# EAGLE design LT3465Breakout (EAGLE 6.1)
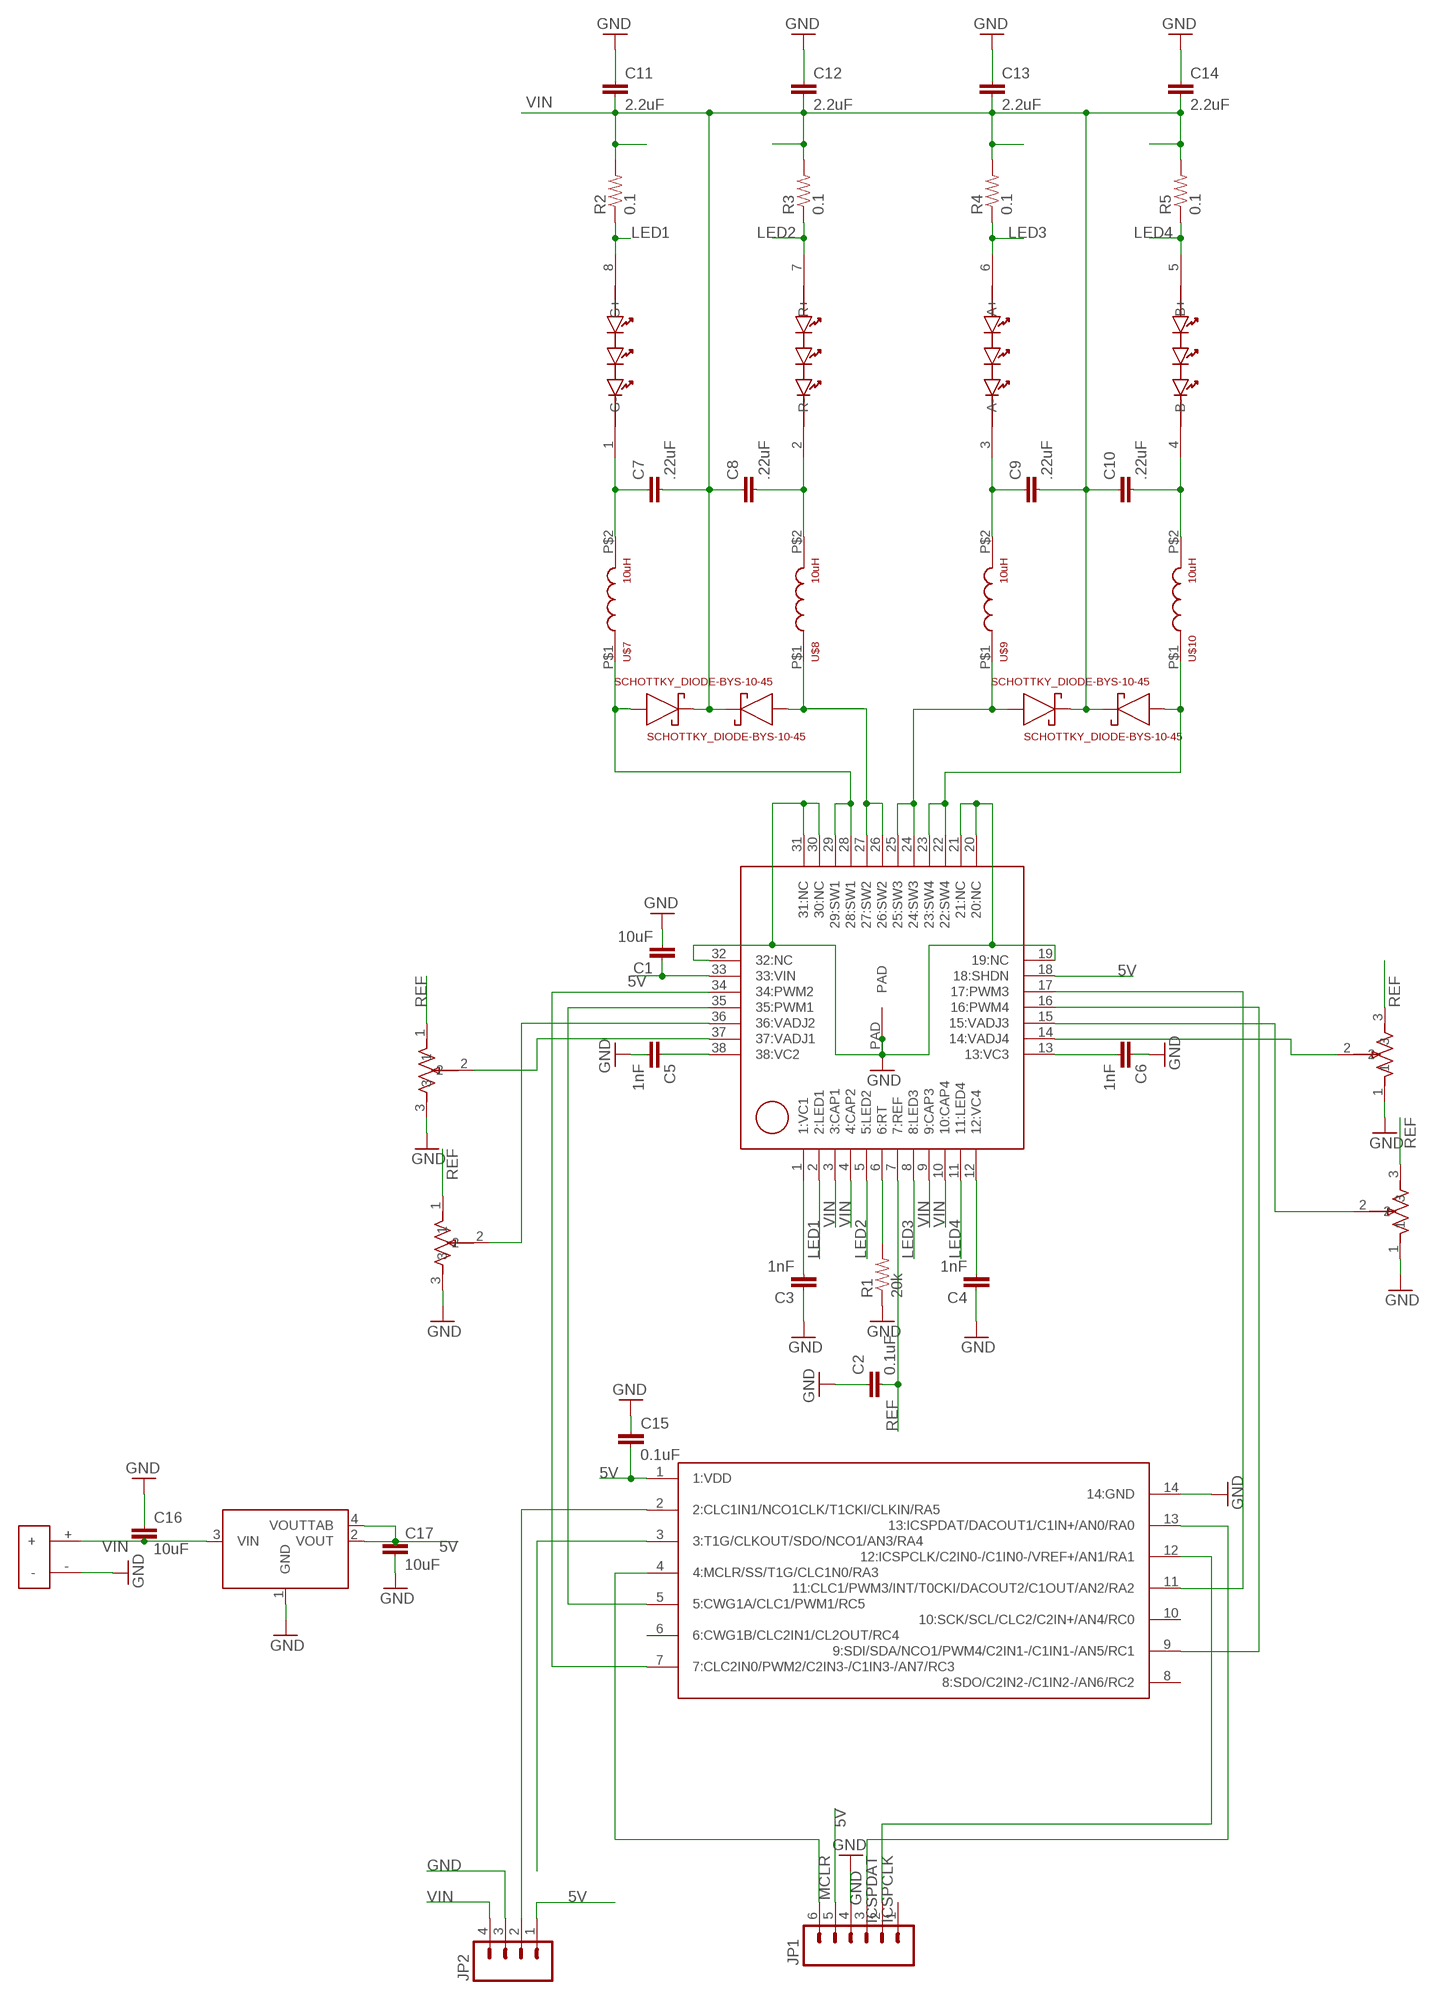
[diagram p0: schematic, sheet 1]

## Parts
C1  10uF  CAP1210  [1210]
C2  0.1uF  CAP0805  [0805]
C3  1nF  CAP0805  [0805]
C4  1nF  CAP0805  [0805]
C5  1nF  CAP0805  [0805]
C6  1nF  CAP0805  [0805]
C7  .22uF  CAP0805  [0805]
C8  .22uF  CAP0805  [0805]
C9  .22uF  CAP0805  [0805]
C10  .22uF  CAP0805  [0805]
C11  2.2uF  CAP1206  [1206]
C12  2.2uF  CAP1206  [1206]
C13  2.2uF  CAP1206  [1206]
C14  2.2uF  CAP1206  [1206]
C15  0.1uF  CAP0805  [0805]
C16  10uF  CAP1206  [1206]
C17  10uF  CAP1206  [1206]
JP1  M06LOCK  [1X06_LOCK]
JP2  M04LOCK  [1X04_LOCK]
R1  20k  RESISTOR  [0805]
R2  0.1  RESISTOR1206  [1206]
R3  0.1  RESISTOR1206  [1206]
R4  0.1  RESISTOR1206  [1206]
R5  0.1  RESISTOR1206  [1206]
U$1  LT3476  [QFN-38]
U$2  PIC16F1503TSSOP14  [TSSOP14]
U$3  SCHOTTKY_DIODE-BYS-10-45  [DO-214]
U$4  SCHOTTKY_DIODE-BYS-10-45  [DO-214]
U$5  SCHOTTKY_DIODE-BYS-10-45  [DO-214]
U$6  SCHOTTKY_DIODE-BYS-10-45  [DO-214]
U$7  10uH  INDUCTOR-LQH88  [LQH88]
U$8  10uH  INDUCTOR-LQH88  [LQH88]
U$9  10uH  INDUCTOR-LQH88  [LQH88]
U$10  10uH  INDUCTOR-LQH88  [LQH88]
U$11  LZC-00-MA00  [LZC-00MA00]
U$12  TRIMPOTTC33X-2  [TC33X-2]
U$13  TRIMPOTTC33X-2  [TC33X-2]
U$14  TRIMPOTTC33X-2  [TC33X-2]
U$15  TRIMPOTTC33X-2  [TC33X-2]
U$16  5V-LDO-ZLDO1117  [ZLDO1117]
U$17  POWER_SOLDER-1.5  [POWER_SOLDER]

## Nets
5V: C1.1 C15.2 C17.1 JP1.5 JP2.1 U$1.18(18:SHDN) U$1.33(33:VIN) U$2.1(1:VDD) U$16.2(VOUT) U$16.4(VOUTTAB)
GND: C1.2 C2.1 C3.1 C4.1 C5.2 C6.1 C11.1 C12.1 C13.1 C14.1 C15.1 C16.1 C17.2 JP1.4 JP2.3 R1.1 U$1.19(19:NC) U$1.20(20:NC) U$1.21(21:NC) U$1.30(30:NC) U$1.31(31:NC) U$1.32(32:NC) U$1.PAD U$2.14(14:GND) U$12.3 U$13.3 U$14.1 U$15.1 U$16.1(GND) U$17.-
ICSPCLK: JP1.2 U$2.12(12:ICSPCLK/C2IN0-/C1IN0-/VREF+/AN1/RA1)
ICSPDAT: JP1.3 U$2.13(13:ICSPDAT/DACOUT1/C1IN+/AN0/RA0)
LED1: R2.1 U$1.2(2:LED1) U$11.8(G+)
LED1B: C7.1 U$7.P$2 U$11.1(G-)
LED2: R3.1 U$1.5(5:LED2) U$11.7(R+)
LED2B: C8.2 U$8.P$2 U$11.2(R-)
LED3: R4.1 U$1.8(8:LED3) U$11.6(A+)
LED3B: C9.1 U$9.P$2 U$11.3(A-)
LED4: R5.1 U$1.11(11:LED4) U$11.5(B+)
LED4B: C10.2 U$10.P$2 U$11.4(B-)
MCLR: JP1.6 U$2.4(4:MCLR/SS/T1G/CLC1N0/RA3)
N$1: U$2.3(3:T1G/CLKOUT/SDO/NCO1/AN3/RA4)
N$2: JP2.2 U$2.2(2:CLC1IN1/NCO1CLK/T1CKI/CLKIN/RA5)
N$5: R1.2 U$1.6(6:RT)
N$6: C3.2 U$1.1(1:VC1)
N$7: C4.2 U$1.12(12:VC4)
N$8: C5.1 U$1.38(38:VC2)
N$9: C6.2 U$1.13(13:VC3)
PWM1: U$1.35(35:PWM1) U$2.5(5:CWG1A/CLC1/PWM1/RC5)
PWM2: U$1.34(34:PWM2) U$2.7(7:CLC2IN0/PWM2/C2IN3-/C1IN3-/AN7/RC3)
PWM3: U$1.17(17:PWM3) U$2.11(11:CLC1/PWM3/INT/T0CKI/DACOUT2/C1OUT/AN2/RA2)
PWM4: U$1.16(16:PWM4) U$2.9(9:SDI/SDA/NCO1/PWM4/C2IN1-/C1IN1-/AN5/RC1)
REF: C2.2 U$1.7(7:REF) U$12.1 U$13.1 U$14.3 U$15.3
SW1: U$1.28(28:SW1) U$1.29(29:SW1) U$3.P$2(ANODE) U$7.P$1
SW2: U$1.26(26:SW2) U$1.27(27:SW2) U$4.P$2(ANODE) U$8.P$1
SW3: U$1.24(24:SW3) U$1.25(25:SW3) U$5.P$2(ANODE) U$9.P$1
SW4: U$1.22(22:SW4) U$1.23(23:SW4) U$6.P$2(ANODE) U$10.P$1
VADJ1: U$1.37(37:VADJ1) U$12.2
VADJ2: U$1.36(36:VADJ2) U$13.2
VADJ3: U$1.15(15:VADJ3) U$15.2
VADJ4: U$1.14(14:VADJ4) U$14.2
VIN: C7.2 C8.1 C9.2 C10.1 C11.2 C12.2 C13.2 C14.2 C16.2 JP2.4 R2.2 R3.2 R4.2 R5.2 U$1.3(3:CAP1) U$1.4(4:CAP2) U$1.9(9:CAP3) U$1.10(10:CAP4) U$3.P$1(CATHODE) U$4.P$1(CATHODE) U$5.P$1(CATHODE) U$6.P$1(CATHODE) U$16.3(VIN) U$17.+
Unconnected: JP1.1 U$2.6(6:CWG1B/CLC2IN1/CL2OUT/RC4) U$2.8(8:SDO/C2IN2-/C1IN2-/AN6/RC2) U$2.10(10:SCK/SCL/CLC2/C2IN+/AN4/RC0)

## Library data of the parts
C1-C17 = 1dah:CAP: Capacitor Standard 0402 ceramic capacitor, and 0.1" leaded capacitor.
JP1 = 1dah:M06: Header 6 Standard 6-pin 0.1" header. Use with straight break away headers (SKU : PRT-00116), right angle break away headers (PRT-00553), swiss pins (PRT-00743), machine pins (PRT-00117), and female headers (PRT-00115). Molex polarized connector foot print use with SKU : PRT-08094 with associated crimp pins and housings. NOTES ON THE VARIANTS LOCK and LOCK_LONGPADS... This footprint was designed to help hold the alignment of a through-hole component (i.e. 6-pin header) while soldering it into place. You may notice that each hole has been shifted either up or down by 0.005 of an inch from it's more standard position (which is a perfectly straight line). This slight alteration caused the pins (the squares in the middle) to touch the edges of the holes. Because they are alternating, it causes a "brace" to hold the component in place. 0.005 has proven to be the perfect amount of "off-center" position when using our standard breakaway headers. Although looks a little odd when you look at the bare footprint, once you have a header in there, the alteration is very hard to notice. Also, if you push a header all the way into place, it is covered up entirely on the bottom side. This idea of altering the position of holes to aid alignment will be further integrated into the Sparkfun Library for other footprints. It can help hold any component with 3 or more connection pins.
JP2 = 1dah:M04: Header 4 Standard 4-pin 0.1" header. Use with straight break away headers (SKU : PRT-00116), right angle break away headers (PRT-00553), swiss pins (PRT-00743), machine pins (PRT-00117), and female headers (PRT-00115). Molex polarized connector foot print use with SKU : PRT-08231 with associated crimp pins and housings.
R1-R5 = 1dah:RESISTOR: Resistor Basic schematic elements and footprints for 0603, 1206, and PTH 1/10th watt (small) resistors.
U$1 = 1dah:LT3476: 4-ch 1.5 amp switching LED power regulator.
U$2 = 1dah:PIC16F1503
U$3-U$6 = 1dah:SCHOTTKY_DIODE: 45V, 1.5A schottky diode
U$7-U$10 = 1dah:INDUCTOR
U$11 = 1dah:LZC-00-MA00
U$12-U$15 = 1dah:TRIMPOT: Bournes Trimpot
U$16 = 1dah:5V-LDO: 5 V LDO, 12V input, 1 A
U$17 = 1dah:POWER_SOLDER

## Board
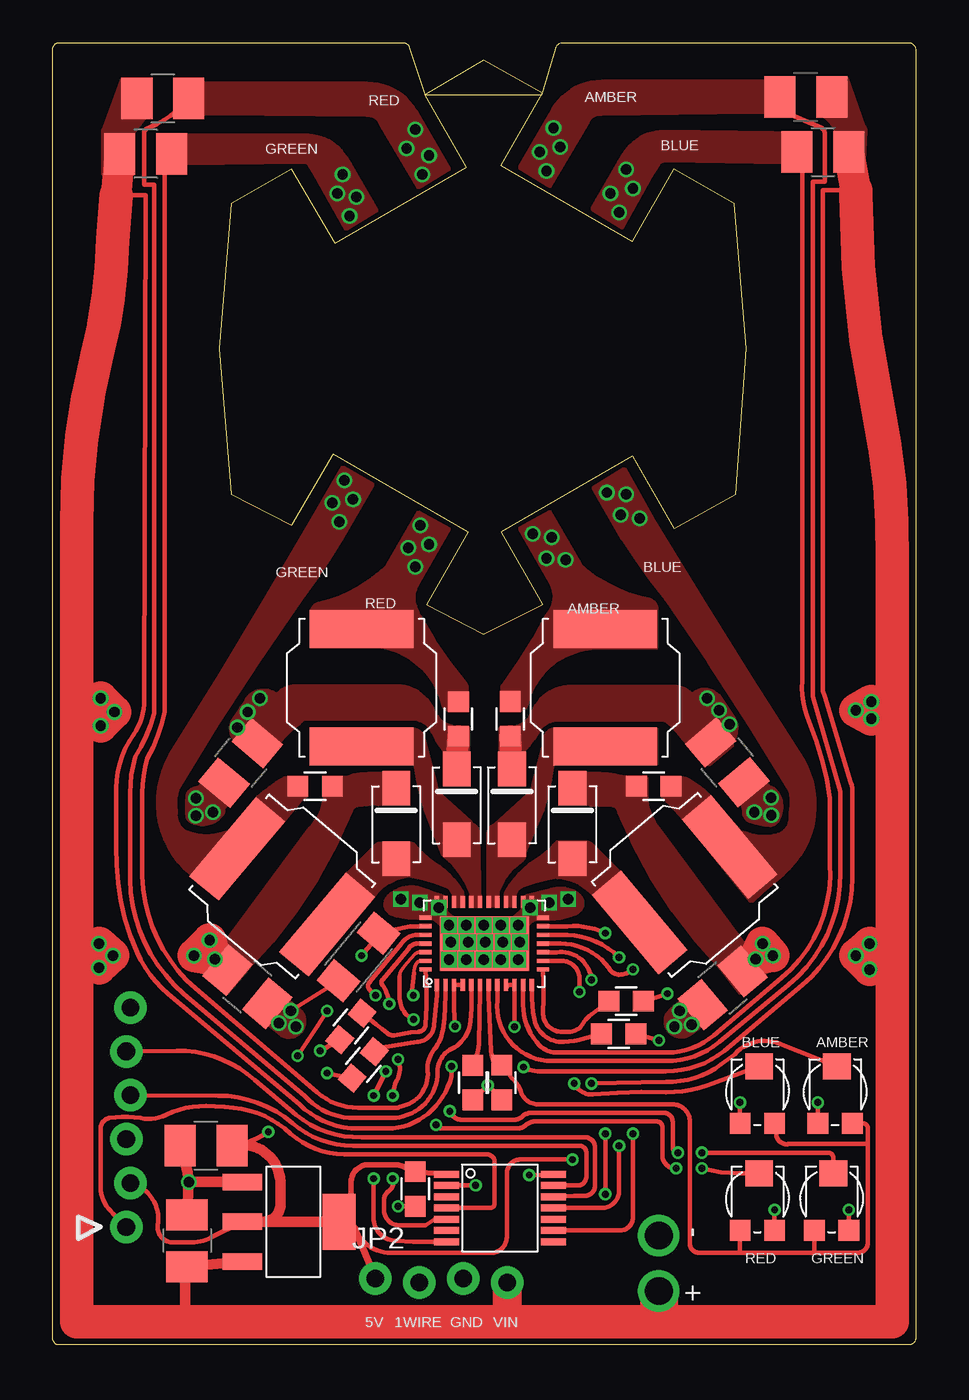
[diagram p1: board, top side]
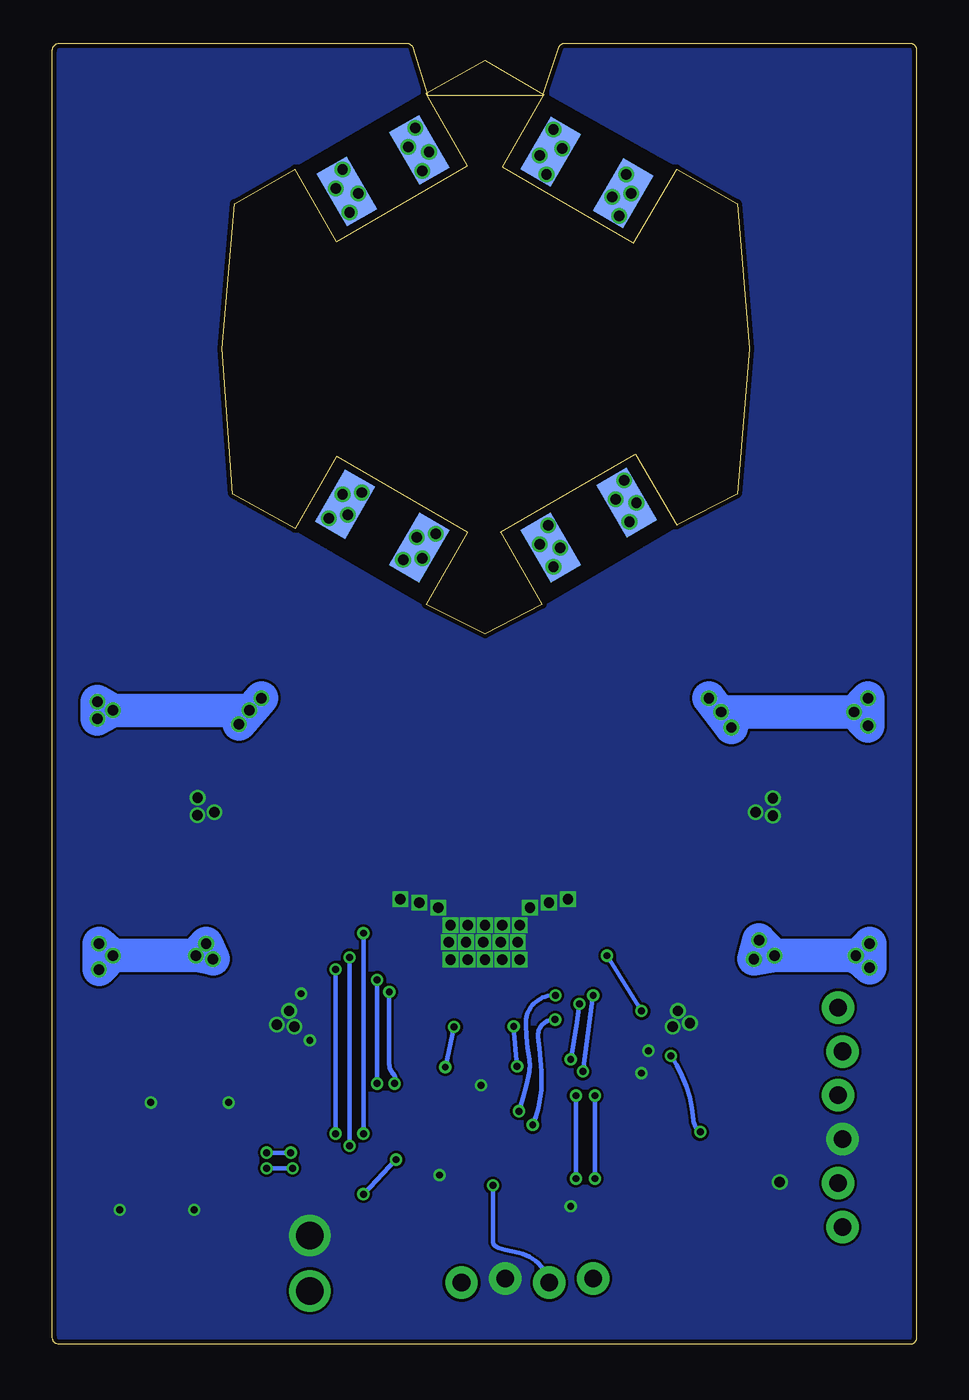
[diagram p2: board, bottom side, seen from below]

Size 50 x 75.3 mm. Coordinates in mm from the lower left corner, seen from the top.
Outline: 0,74.94 0,0.36 arc90 0.36,0 49.59,0 arc90 50,0.41 50,74.89 arc90 49.59,75.3 29.51,75.3 arc73 29.11,75.01 28.3,72.3 21.6,72.3 20.68,75.05 arc72 20.34,75.3 0.36,75.3 arc90 0,74.94
Copper layers (1*16): Top 0.035mm / dielectric 1.5mm / Bottom 0.035mm
Design rules: minimum track width 6mil, minimum drill 12mil, track to track 6mil, track to pad 6mil, pad to pad 6mil, via to via 6mil, smd to smd 0mil, copper to edge 10mil, drill to drill 10mil, minimum pad ring 10mil, minimum via ring 6mil, stop-mask expansion 2mil, vias tented up to drill 100mil, thermal gap 10mil

### Footprints (pad centres in the part's own frame; a part is rotated, then mirrored left to right if it is on the bottom)
1210 = smd 1.6 x 2: 1 -1.8,0; 2 1.8,0
0805 = smd 1.2 x 1.2: 1 -1,0; 2 1,0
1206 = smd 1.8 x 2.4: 1 -1.5,0; 2 1.5,0
1X06_LOCK = drill 1.016 pad 1.88: 1 0,0.127; 2 2.54,-0.127; 3 5.08,0.127; 4 7.62,-0.127; 5 10.16,0.127; 6 12.7,-0.127
1X04_LOCK = drill 1.016 pad 1.88: 1 0,0.127; 2 2.54,-0.127; 3 5.08,0.127; 4 7.62,-0.127
QFN-38 = smd 0.7 x 0.25: 1 -2.4,2.75; 2 -2.4,2.25; 3 -2.4,1.75; 4 -2.4,1.25; 5 -2.4,0.75; 6 -2.4,0.25; 7 -2.4,-0.25; 8 -2.4,-0.75; 9 -2.4,-1.25; 10 -2.4,-1.75; 11 -2.4,-2.25; 12 -2.4,-2.75; 20 2.4,-2.75; 21 2.4,-2.25; 22 2.4,-1.75; 23 2.4,-1.25; 24 2.4,-0.75; 25 2.4,-0.25; 26 2.4,0.25; 27 2.4,0.75; 28 2.4,1.25; 29 2.4,1.75; 30 2.4,2.25; 31 2.4,2.75 | smd 0.25 x 0.7: 13 -1.5,-3.4; 14 -1,-3.4; 15 -0.5,-3.4; 16 0,-3.4; 17 0.5,-3.4; 18 1,-3.4; 19 1.5,-3.4; 32 1.5,3.4; 33 1,3.4; 34 0.5,3.4; 35 0,3.4; 36 -0.5,3.4; 37 -1,3.4; 38 -1.5,3.4 | smd 3.15 x 5.15: PAD 0,0
TSSOP14 = smd 0.4 x 1.45: 1 -1.95,-3.1; 2 -1.3,-3.1; 3 -0.65,-3.1; 4 0,-3.1; 5 0.65,-3.1; 6 1.3,-3.1; 7 1.95,-3.1; 8 1.95,3.1; 9 1.3,3.1; 10 0.65,3.1; 11 0,3.1; 12 -0.65,3.1; 13 -1.3,3.1; 14 -1.95,3.1
DO-214 = smd 2 x 1.6: P$1 -2.1,0; P$2 2,0
LQH88 = smd 2.2 x 6: P$1 -3.4,0; P$2 3.4,0
LZC-00MA00 = smd 2 x 3.5 rotated 60 bottom: 1 -8.9,8.2; 2 -11.5,3.8; 5 9.1,-8; 6 11.5,-3.8 | smd 3.5 x 2 rotated 30 bottom: 3 -11.5,-3.8; 4 -9,-8.1; 7 11.4,3.8; 8 9,8
TC33X-2 = smd 1.2 x 1.2: 1 -1,-1.8; 3 1,-1.8 | smd 1.6 x 1.5: 2 0.1,1.5
ZLDO1117 = smd 0.95 x 2.3: 1 -2.3,-3; 2 0,-3; 3 2.3,-3 | smd 3.25 x 1.9: 4 0,2.6
POWER_SOLDER = drill 1.6: + 1.6,0; - -1.6,0

### Placement (x,y rotation side)
C1  17.72,22.43 230 top
C2  26.01,15.16 90 top
C3  17.99,16.18 50 top
C4  32.78,17.98 180 top
C5  17.28,18.41 230 top
C6  33.21,19.86 180 top
C7  15.2,32.3 0 top
C8  23.5,36.2 90 top
C9  26.5,36.2 270 top
C10  34.8,32.3 0 top
C11  11.28,20.69 140 top
C12  10.9,33.66 50 top
C13  39.06,33.69 130 top
C14  38.79,20.63 40 top
C15  21,9 90 top
C16  7.8,6 270 top
C17  8.9,11.5 180 top
JP1  4.4,19.5 270 top
JP2  18.7,3.7 0 top
R1  24.33,15.15 90 top
R2  5.4,68.9 180 top
R3  6.4,72.1 180 top
R4  43.6,72.2 0 top
R5  44.6,69 0 top
U$1  25,23.2 90 top
U$2  25.9,7.9 270 top
U$3  19.9,30.1 270 top
U$4  23.4,31.2 270 top
U$5  26.6,31.2 270 top
U$6  30.1,30.1 270 top
U$7  13.3,26.5 140 top
U$8  17.9,38 90 top
U$9  32,38 90 top
U$10  36.6,26.6 40 top
U$11  24.96,57.62 90 top
U$12  45.1,8.4 0 top
U$13  40.8,8.4 0 top
U$14  40.8,14.6 0 top
U$15  45.3,14.6 0 top
U$16  14,7.1 270 top
U$17  35.1,4.7 270 top

### Tracks (layer width: path | path; a pad name or v marks a point on that pad's centre or on a via)
5V  (via drill 0.4)
  Top 0.254: U$1.33 20.7,24.2 C1.1 18.9,23.7 v17.9,22.5 | U$1.18 29.8,24.2 arc-31 v32,23.8 | U$16.2 9.2,6.2 arc-31 8.08,5.91 6.98,5.91 arc-97 6.1,6.9 arc85 JP1.5 | 17.5,6.7 arc72 19.8,5.3 25.4,5.3 arc90 26.3,6.2 26.3,9.9 arc-97 27.2,10.7 v30.1,10.7 | v32,8.7 v32,12.2 | v15.9,19.3 arc-2 v14.2,16.7 | v12.5,12.3 arc-26 C17.1
  Top 0.305: U$2.1 C15.2 20.3,10.3 arc27 19.7,10.4 18.3,10.4 arc95 17.3,9.3 17.3,7.2 17.5,6.7
  Top 0.406: U$16.4 arc-67 17.5,6.7 JP2.1
  Top 0.61: C17.1 arc-107 13.2,9.2 13.2,8.1 arc-90 12.2,7.1 U$16.2 U$16.4
  Bottom 0.254: v32,23.8 v32,12.2 | v30.1,10.7 v32,8.7 | v17.9,22.5 v15.9,19.3 | v14.2,16.7 arc30 12.9,13 arc-51 v12.5,12.3
GND  (via drill 0.4, 0.6)
  Top 0.2: U$1.PAD v25.06,23.27
  Top 0.254: C1.2 v13.8,19.3 | v15.5,17 C5.2 | v15.9,15.7 C3.1 | C6.1 v35.6,20.3 | C4.1 v35.1,17.6 | C2.1 v25.2,15 R1.1 | v20,8 C15.1 | v27.6,9.8 U$2.14 | U$14.1 v39.8,14 | U$15.1 v44.3,14 | U$13.3 v41.8,7.8 | U$12.3 v46.1,7.8
  Top 0.61: C16.1 v7.9,9.4 | v7.9,9.4 arc14 C17.2 | v7.9,9.4 10.7,9.4 arc37 U$16.1
  other vias: 22.96,24.27 23.96,24.27 24.96,24.27 25.96,24.27 26.96,24.27 27.06,23.27 26.06,23.27 24.06,23.27 23.06,23.27 22.96,22.27 23.96,22.27 24.96,22.27 25.96,22.27 26.96,22.27 8.3,31.6 9.3,30.8 8.3,30.6 40.63,30.8 41.59,31.65 41.61,30.63 22.36,25.27 27.66,25.27 21.26,25.57 20.16,25.77 28.76,25.57 29.86,25.77 13.1,18.6 14.1,18.4 36,18.4 36.3,19.3 37,18.5
  pour Bottom (no thermals): -4.5,54.3 -4.5,-2.7 62.5,-2.7 62.6,77.6 -4.4,77.9
  pour Top (no thermals): 27.22,25.86 27.86,25.86 28.76,24.87 28.76,24.57 27.95,24.57 arc45 27.79,24.5 27.56,24.27 27.06,24.27 27.06,24.77 26.66,24.67 27.12,25.09 arc49 27.22,25.3
  pour Top (no thermals): 22.78,25.86 22.13,25.96 21.25,24.87 21.25,24.67 21.92,24.67 arc-45 21.99,24.64 22.46,24.27 22.96,24.27 22.96,24.77 23.26,24.67 22.92,24.96 arc-50 22.78,25.25
  pour Top (no thermals): 9.7,33.7 11.2,32.5 10,31.1 arc45 9.9,30.8 arc-45 9.7,30.5 arc-73 8.1,30.2 arc-58 7.8,30.5 arc-16 7.8,31.7 arc-74 8.2,32.2 arc21 8.5,32.3
  pour Top (no thermals): 38.82,32.56 40.26,33.83 41.41,32.39 arc45 41.59,32.24 arc-45 41.87,32.09 arc-73 41.95,30.25 arc-58 41.51,30.02 arc-16 40.42,30.23 arc-74 40.02,30.81 arc21 39.97,31.12
  pour Top (no thermals): 22.78,25.86 22.4,26 arc4 21.3,26.4 arc57 19.5,26 arc118 19.6,24.9 arc20 21.25,24.67 arc83
  pour Top (no thermals): 27.22,25.86 27.5,26 arc-4 28.7,26.3 arc-57 30.4,26.1 arc-118 30.3,24.9 arc-20 28.75,24.57 arc-83
  pour Top (no thermals): 11.2,19.5 13.1,18 arc181 14.3,19.4 12.4,21
  pour Top (no thermals): 38.8,19.4 37,18 arc-181 35.8,19.4 37.6,20.9
ICSPCLK
  Top 0.254: JP1.2 7.2,17 arc-43 11.7,15.3 14.1,13.3 arc42 17.9,12 30.8,12 arc-90 31.4,11.4 31.4,9.2 arc-90 30.8,8.6 arc3 U$2.12
ICSPDAT
  Top 0.254: JP1.3 9.6,14.4 arc-40 13.9,12.8 arc40 17.4,11.5 30.5,11.5 arc-90 30.9,11.1 30.9,9.7 arc-90 30.4,9.2 U$2.13
LED1  (via drill 0.6)
  Top 0.254: U$1.2 22.75,20.22 arc-8 22.6,18.2 arc-27 22.2,17.2 arc36 21.7,16 arc-86 20.3,13.8 arc7 20,13.7 17.7,13.7 arc-46 15.1,14.8 8.3,20.6 arc-48 5.2,27.1 5.2,31.9 arc-17 5.5,33.9 arc17 6.5,36.6 6.5,68.7 R2.1
  Bottom 0.254: U$11.8 v16.5,66.6
  other vias: 17.2,65.3 17.6,66.4 16.8,67.7
  pour Top (no thermals): 17,68.7 18.8,65.6 17,64.5 15.2,67.7 14.9,68.2 arc65 14.5,68.4 7.7,68.3 6.1,68.3 6.1,70 14.6,70 arc-61
LED1B  (via drill 0.6)
  Bottom 0.254: U$11.1 v16.2,48.7
  other vias: 16.9,50 17.4,48.9 16.6,47.6
  pour Top (no thermals): 9.6,25.8 13.4,30.3 arc1 14.4,31.5 arc-28 14.7,31.7 14.7,32.8 13.6,32.8 arc28 13.3,32.7 arc15 11.9,31.7 8.1,27.1
  pour Top (no thermals): 9.6,25.8 12,28.7 10.2,29.7 9.9,29.6 arc-43 7.7,29.7 arc-70 7.2,30.9 arc-26 7.3,32.2 arc-4 14.4,43.1 arc6 16.8,46.7 18.6,49.8 16.8,50.8 15,47.7 arc-2 6.8,34.1 arc80 8,27.2
LED2  (via drill 0.6)
  Top 0.254: U$1.5 24.25,19.81 arc-5 24.2,18.7 arc-59 23.1,17.1 arc65 22.3,15.8 arc-76 20.3,13.2 arc-14 19.5,13.1 17.5,13.1 arc-48 14.6,14.4 7.6,20.3 arc-48 4.5,26.9 4.5,31.9 arc-16 4.8,34 arc14 5.9,36.5 5.9,67.1 5.3,67.1 5.3,70.1 arc-72 5.6,70.4 arc28 R3.1
  Bottom 0.254: U$11.7 v20.5,69.2
  other vias: 21.4,67.7 21.8,68.8 21,70.3
  pour Top (no thermals): 21.2,71.1 23,68 21.2,66.9 19,70.6 arc78 18.2,71.1 9.3,71.2 7.3,71.2 7.3,73 18.2,73 arc-65
LED2B  (via drill 0.6)
  Bottom 0.254: v20.6,46.1 U$11.2
  other vias: 21.3,47.4 21.8,46.3 21,45
  pour Top (no thermals): 24,38 24,36.7 22.9,36.7 arc-77 22.6,37 arc76 18.4,40.4 15,40.4 15,42.4 20.9,42.4 arc-62 21.3,42.1 arc11 23.9,38.3 arc-42
  pour Top (no thermals): 15,40.4 15,42.3 arc-80 15.4,42.9 arc32 19.4,45.1 21.2,48.2 23,47.2 21.2,44.1 arc67 21.2,42.3 18.6,40.4
LED3  (via drill 0.6)
  Top 0.254: U$1.8 25.75,19.89 arc96 28.9,16.4 arc-2 35.5,16.4 arc39 38.6,17.5 42.6,20.8 arc51 45.6,27.3 45.6,32 44,37.5 44,67.3 44.7,67.3 44.7,70.1 arc67 44.5,70.4 42.4,71.3 41.7,72.2
  Bottom 0.16: U$11.6 v28.2,69
  other vias: 29,70.4 29.4,69.3 28.6,67.9
  pour Top (no thermals): 28.8,71.2 27,68.1 28.8,67 31,70.7 arc-78 31.8,71.2 40.7,71.3 42.7,71.3 42.7,73.1 31.8,73.1 arc65
LED3B  (via drill 0.6)
  Bottom 0.254: U$11.3 v28.9,46.7
  other vias: 27.8,46.9 28.6,45.5 29.7,45.4
  pour Top (no thermals): 26,38 26,36.7 27.1,36.7 arc77 27.5,37.1 arc-76 31.6,40.3 35,40.3 35,42.5 29.1,42.5 arc62 28.6,42.2 arc-11 26.1,38.2 arc42
  pour Top (no thermals): 35,40.3 35,42.5 arc80 34.6,43.1 arc-32 30.6,45.1 28.8,48.2 27,47.2 28.8,44.1 arc-67 28.7,42.3 31.4,40.3
LED4  (via drill 0.6)
  Top 0.254: U$1.11 27.25,19.65 arc44 28.2,17.3 arc48 29.2,16.9 35.6,16.9 arc41 38.3,17.9 42.2,21.2 arc54 45,27.8 45,31.6 arc15 43.8,36 arc-27 43.4,38.4 43.4,68.8 R5.1
  Bottom 0.16: U$11.5 v33.6,66.9
  other vias: 32.8,65.5 32.3,66.6 33.2,68
  pour Top (no thermals): 33,68.8 31.2,65.7 33,64.6 34.8,67.8 35.1,68.3 arc-65 35.5,68.5 42.3,68.4 43.9,68.4 43.9,70.1 35.4,70.2 arc61
LED4B  (via drill 0.6)
  Bottom 0.254: U$11.4 v33.2,49.2
  other vias: 32.1,49.3 32.9,48 34,47.8
  pour Top (no thermals): 40.5,25.6 36.6,30.3 arc-1 35.6,31.4 arc28 35.3,31.7 35.3,32.8 36.4,32.8 arc-28 36.8,32.7 arc-15 38,31.8 42.1,27.1
  pour Top (no thermals): 40.4,25.6 37.9,28.7 39.9,29.7 40.2,29.6 arc43 42.2,29.6 arc70 42.7,30.8 arc26 42.7,32 arc4 35.5,43.1 arc-6 33,46.6 31.3,49.6 33.1,50.7 34.8,47.7 arc2 43.4,33.9 arc-80 42.3,27.2
MCLR
  Top 0.254: JP1.6 3.5,7.6 arc-53 2.8,9.3 2.8,12.5 arc-80 3.3,13.1 arc-21 5.1,13.1 arc36 6.6,13.3 arc-27 8.9,13.8 arc-5 10.5,13.7 arc-37 13.8,12.2 arc45 17.3,11 25.1,11 arc-100 25.6,10.5 25.6,8.2 arc-103 25.3,7.9 U$2.4
N$2  (via drill 0.4)
  Top 0.254: U$2.2 v24.5,9.2
  Bottom 0.254: v24.5,9.2 24.5,6 arc-74 24.2,5.6 arc-4 23,5.3 arc65 JP2.2
N$5
  Top 0.254: R1.2 24.4,16.4 arc23 24.7,17.4 24.75,20.45 U$1.6
N$6
  Top 0.254: C3.2 19.1,17.2 21.1,17.5 arc84 22.1,18.5 22.25,20.21 U$1.1
N$7
  Top 0.254: C4.2 30.8,17.7 arc-13 29.6,17.5 arc-81 27.9,18.8 arc-14 27.75,20.44 arc3 U$1.12
N$8
  Top 0.254: C5.1 arc0 18.4,18.8 arc-1 19.4,18 arc50 19.8,17.9 arc-6 21.2,18.1 arc79 21.6,18.5 arc11 U$1.38
N$9
  Top 0.254: C6.2 31.2,19.1 arc25 30.6,18.4 arc-56 29.6,18.1 arc-98 28.4,19.2 arc5 U$1.13
PWM1  (via drill 0.4)
  Top 0.254: U$1.35 21.2,23.2 arc62 20.6,22.9 19.1,21.1 arc80 19.1,20.8 arc-32 v19.5,19.7 | v20,16.5 arc-45 20,15.4 arc27 v19.7,14.4 | v19.7,9.6 arc-67 19.5,8.9 arc67 19.2,8.3 19.2,7.9 arc99 20.1,6.9 21.6,6.9 22.12,7.23 U$2.5
  Bottom 0.254: v19.5,19.7 arc5 v20,16.5 | v19.7,14.4 v19.7,9.6
PWM2  (via drill 0.4)
  Top 0.254: U$1.34 21.2,23.7 arc58 20.2,23.2 18.4,21 arc108 18.4,20.5 v18.7,20.2 | v19.3,15.8 v18.6,14.4 | v18.6,9.6 18.6,7.2 arc85 19.9,6 arc6 U$2.7
  Bottom 0.254: v18.7,20.2 v19.3,15.8 | v18.6,14.4 v18.6,9.6
PWM3  (via drill 0.4)
  Top 0.254: U$1.17 29.4,23.7 arc-48 v32.8,22.4 | v32.8,11.5 32.8,8.9 arc-90 31.8,7.9 U$2.11
  Bottom 0.254: v32.8,22.4 v32.8,11.5
PWM4  (via drill 0.4)
  Top 0.254: U$1.16 29.4,23.2 arc-53 32.2,21.8 arc60 32.8,21.4 arc40 v33.6,21.7 | v33.6,12.2 33.6,7.4 arc-90 32.9,6.6 arc2 U$2.9
  Bottom 0.254: v33.6,21.7 v33.6,12.2
REF
  Top 0.254: U$1.7 25.25,20.17 25.4,17 arc15 25.6,16.1 C2.2 26.6,15.4 arc-25 27.1,14.7 arc78 28.1,13.9 arc2 33.7,13.9 arc-2 35.4,13.9 arc2 35.8,13.9 arc-99 36.9,12.8 36.9,6 arc98 37.4,5.3 39.8,5.3 | 39.8,5.3 44.1,5.3 | 44.1,5.3 46.6,5.3 arc90 47.2,5.9 47.2,11.6 | 47.2,11.6 47.2,12.5 arc90 46.9,12.8 U$15.3 | U$13.1 39.8,5.3 | U$12.1 44.1,5.3 | U$14.3 41.9,12.1 arc93 42.6,11.6 47.2,11.6
SW1
  pour Top (no thermals): 23.22,25.35 23.78,25.35 23.78,26.06 arc31 23.69,26.28 arc22 22.42,27.67 arc-18 21,28.89 arc38 20.7,29 19.2,29 19.2,27.2 arc-24 22.8,26.5 arc-49 23.22,25.94
  pour Top (no thermals): 20.6,29 19.1,29 arc44 18.7,28.9 arc-1 17.1,27.3 13.2,22.7 14.8,21.4 18.6,25.9 arc-49 20.6,27.1
SW2
  pour Top (no thermals): 24.22,25.35 24.78,25.35 24.68,29.58 arc92 24.24,30.1 22.7,30.1 22.7,28.2 arc-32 24.18,26.18 arc-23 24.22,25.95
  pour Top (no thermals): 22.6,28.3 21.6,30.9 arc-11 21,33.6 15,33.6 15,35.6 20.9,35.6 arc-90 21.5,35 22.2,32.37 arc47 22.5,31.81 24.2,30.3 24.4,30
SW3
  pour Top (no thermals): 25.78,25.35 25.22,25.35 25.22,29.58 arc-92 25.76,30.1 27.3,30.1 27.3,28.2 arc-53 27.2,28 arc32 25.82,26.28 arc23 25.78,25.95
  pour Top (no thermals): 27.3,28.3 28.4,30.9 arc11 29,33.6 35,33.6 35,35.6 29.1,35.6 arc90 28.5,35.1 27.8,32.37 arc-47 27.5,31.81 25.6,30.1 25.6,30
SW4
  pour Top (no thermals): 26.78,25.35 26.22,25.35 26.22,25.96 arc-31 26.31,26.28 arc-22 27.58,27.77 arc18 29,28.89 arc-38 29.3,29.1 30.9,29.1 30.9,27.1 arc-90 30.8,27.1 arc24 27.2,26.5 arc49 26.78,26.04
  pour Top (no thermals): 29.2,29.1 30.8,29.1 arc-44 31.3,28.9 arc1 32.8,27.4 36.6,22.8 35.1,21.5 31.3,26 arc49 29.2,27
VADJ1  (via drill 0.4)
  Top 0.2: 20.92,21.5 arc0 21,21.9 arc-67 21.3,22.2
  Top 0.254: U$12.2 45.2,10.8 arc90 44.9,11.1 v37.6,11.1 | v36.2,11.1 arc-90 35.9,11.4 35.9,12.9 arc90 35.4,13.4 27.7,13.4 arc44 27.2,13.2 arc-50 26.6,13 23.7,13 arc-71 v23,13.5 | v20.89,20.2 20.82,20.49 20.92,21.5 | 21.3,22.2 U$1.37
  Bottom 0.254: v37.6,11.1 v36.2,11.1 | v23,13.5 arc-9 22.4,15.8 arc-21 22.4,16.5 arc9 22.6,18.5 arc96 v20.89,20.2
VADJ2  (via drill 0.4)
  Top 0.2: 20.1,21.3 arc-37 20.3,21.8 arc-9 21,22.6 arc-52 21.4,22.7
  Top 0.254: U$13.2 39.8,9.9 arc-16 v37.6,10.2 | v36.1,10.2 arc-98 35.3,11 35.3,12.6 arc90 35,12.9 27.9,12.9 arc44 27.4,12.7 arc-44 26.9,12.5 22.5,12.5 arc-67 v22.2,12.7 | v20.9,18.8 arc-54 20.7,18.9 arc-49 20.1,20 20.1,21.3 | 21.4,22.7 arc15 U$1.36
  Bottom 0.254: v37.6,10.2 v36.1,10.2 | v22.2,12.7 arc-27 21.7,15.8 arc-3 21.9,17.8 arc98 v20.9,18.8
VADJ3  (via drill 0.4)
  Top 0.254: U$15.2 42.1,17.4 arc69 39.5,16.8 38.7,16.2 arc-39 35.5,15.2 v31.2,15.1 | v31.2,21.1 arc93 29.2,22.7 arc-6 U$1.15
  Bottom 0.254: v31.2,15.1 v31.2,21.1
VADJ4  (via drill 0.4)
  Top 0.254: U$14.2 37.9,15 arc-21 35.5,14.6 arc6 31.3,14.47 arc-69 v30.2,15.1 | v30.5,20.4 arc-3 30.5,21.2 arc93 29.4,22.2 U$1.14
  Bottom 0.254: v30.2,15.1 arc-70 30.3,15.7 arc46 30.5,16.2 v30.5,20.4
VIN  (via drill 0.4, 0.6)
  Top 0.254: U$1.4 U$1.3 arc0 23.25,20.02 arc3 v23.3,18.4 | 3.7,66.5 5.4,66.5 5.3,37.3 arc-38 4.7,35.3 arc36 3.7,32.2 3.7,28.8 arc25 4.9,22.7 arc26 6.7,20.3 14.3,13.9 arc45 17.7,12.5 19.4,12.5 arc50 22.2,13.8 arc25 23.1,15.5 arc-6 v23.1,16.1 | 26.3,20.7 U$1.9 U$1.10 v26.75,18.37 | v27.26,16.05 27.6,15.9 arc19 28.4,15.8 35.5,15.8 arc39 38.9,17 43.4,20.8 arc50 46.3,27 46.3,32.1 arc28 46.2,32.5 44.7,37.5 44.6,37.8 44.6,66.8 46.5,66.8 | 1.4,1.3 7.7,1.2 | 7.7,4.5 C16.2
  Top 0.406: U$17.+ 35.2,3.1 35.2,1.2 39.6,1.2 39.6,1.3
  Top 0.61: 7.7,1.2 7.7,4.5 | C16.2 U$16.3
  Top 1.27: U$4.P$1 C8.1 | U$5.P$1 C9.2
  Top 1.676: JP2.4 26.3,3.57 26.3,1.3
  Top 1.778: R5.2 46.5,66.8 | 3.7,66.5 R2.2
  Top 1.93: 46.5,66.8 46.5,66.5 arc12 47.8,54.1 arc-13 48.6,45.4 48.6,36.7 | 48.6,36.7 48.6,22.5 | 48.6,22.5 48.6,1.3 39.6,1.3 26.3,1.3 1.4,1.3 1.4,22.5 | 1.4,22.5 1.4,36.6 | 1.4,36.6 1.4,47.6 arc-14 2.6,57.3 arc13 3.5,63.9 3.7,66.5 | v46.5,36.7 48.6,36.7 | v47.4,36.2 v46.5,36.7 | v46.5,36.7 v47.4,37.2 | v3.6,36.6 v2.8,35.8 v2.8,37.4 v3.6,36.6 | v46.5,22.5 v47.3,23.2 v47.3,21.7 v46.5,22.5 | v46.5,22.5 48.6,22.5 | v3.6,36.6 1.4,36.6 | v3.5,22.5 v2.7,23.2 v2.7,21.8 v3.5,22.5 | v3.5,22.5 1.4,22.5 | v40.7,22.3 v41.1,23.2 v41.7,22.5 v40.7,22.3 | v8.2,22.5 v9.4,22.3 v9.1,23.4 v8.2,22.5
  Top 2.184: U$17.+ 35.1,1.5
  Bottom 0.254: v23.3,18.4 v23.1,16.1 | v26.75,18.37 v27.26,16.05
  Bottom 1.93: v38.6,36.7 v46.5,36.7 | v46.5,36.7 v47.4,37.2 v47.4,36.2 v46.5,36.7 | v11.3,36.6 v3.6,36.6 | v10.7,35.7 v12,37.4 | v37.9,37.4 v39.2,35.9 | v3.6,36.6 v2.8,37.4 v2.8,35.8 v3.6,36.6 | v41.7,22.5 v41.1,23.2 v40.7,22.3 v41.7,22.5 | v41.7,22.5 v46.5,22.5 | v46.5,22.5 v47.3,23.2 v47.3,21.7 v46.5,22.5 | v8.2,22.5 v9.1,23.4 v9.4,22.3 v8.2,22.5 | v8.2,22.5 v3.5,22.5 v2.7,21.8 v2.7,23.2 3.5,22.4
  pour Top (no thermals): 15.7,32.8 15.7,31.8 16.8,31.8 arc-26 18.5,31.3 arc25 18.9,31.2 20.6,31.3 20.6,33.1 19.1,33.1 arc13 17.4,33 arc-8 16.8,32.8
  pour Top (no thermals): 34.4,32.9 34.4,31.7 33.2,31.7 arc26 31.5,31.3 arc-25 31.1,31.2 29.4,31.3 29.4,33.1 30.9,33.1 arc-13 32.6,33 arc8 33.2,32.9
  pour Top (no thermals): 22.7,34.3 22.7,32.4 24.1,32.4 24.1,35.7 23.7,35.7 arc-65 22.1,36.6 arc64 20.2,38.1 14,38.1 arc57 12.9,37.5 11.9,36.3 10.7,34.8 12.1,33.6 13.3,35 arc-14 14.3,35.9 arc-33 14.6,36.2 20.9,36.2 arc-62 22,35.4 arc9
  pour Top (no thermals): 27.3,34.3 27.3,32.4 25.9,32.4 25.9,35.7 26.4,35.7 arc65 27.8,36.6 arc-64 29.8,38.1 36,38.1 arc-57 37.1,37.5 38.1,36.3 39.4,34.7 38,33.5 36.5,35 arc14 35.7,35.9 arc33 35.4,36.1 29.1,36.1 arc62 28.1,35.4 arc-9
  pour Top (no thermals): 34.4,32.8 34.4,31.7 arc43 35.1,29.9 40.2,23 41.4,21.6 39.8,20.3 38.7,21.7 arc-22 32.8,30.8 arc75 32.3,31.2 31.1,31.2 32.3,32.8
  pour Top (no thermals): 37.8,33.5 39.2,34.7 arc76 39.5,36.2 38.7,37.4 arc101 37,37.6 arc87 36.9,34.9 arc-7
  pour Top (no thermals): 44.3,73.1 44.4,71.3 45.1,70.6 arc-62 45.3,70.1 45.3,67.9 47,67.9 47.1,70.2 arc44 47,70.5 46,73.3
  pour Top (no thermals): 5.7,73.2 5.7,71.4 4.7,70.1 4.7,67.7 2.9,67.7 2.9,70.1 arc-44 3,70.4 4,73.2
  pour Top (no thermals): 12.2,33.5 10.8,34.7 arc-76 10.4,36.1 11.2,37.3 arc-101 13,37.6 arc-87 13.1,34.9 arc7
  pour Top (no thermals): 38.7,21.8 39.9,20.4 41.4,21.6 arc-25 41.6,21.7 arc120 42,23.1 arc2 41.7,23.4 arc104 40.3,23.2 arc6 40.2,23
  pour Top (no thermals): 15.7,32.8 15.7,31.7 arc-43 14.9,29.9 9.8,23 8.6,21.6 10.1,20.3 11.3,21.7 arc22 17.3,30.8 arc-75 17.7,31.2 18.9,31.3 17.7,32.8

### Text on the board
tPlace: RED | AMBER | GREEN | BLUE | BLUE | GREEN | RED | AMBER | BLUE | AMBER | RED | GREEN | 5V | 1WIRE | GND | VIN